# Altium schematic sheet Speed.SchDoc: Speed
size A4; Author: João Guimarães; Organization: Altium Limited; Address1: L3, 12a Rodborough Rd; Address2: Frenchs Forest; Address3: NSW; Address4: Australia 2086; Revision: 2.0
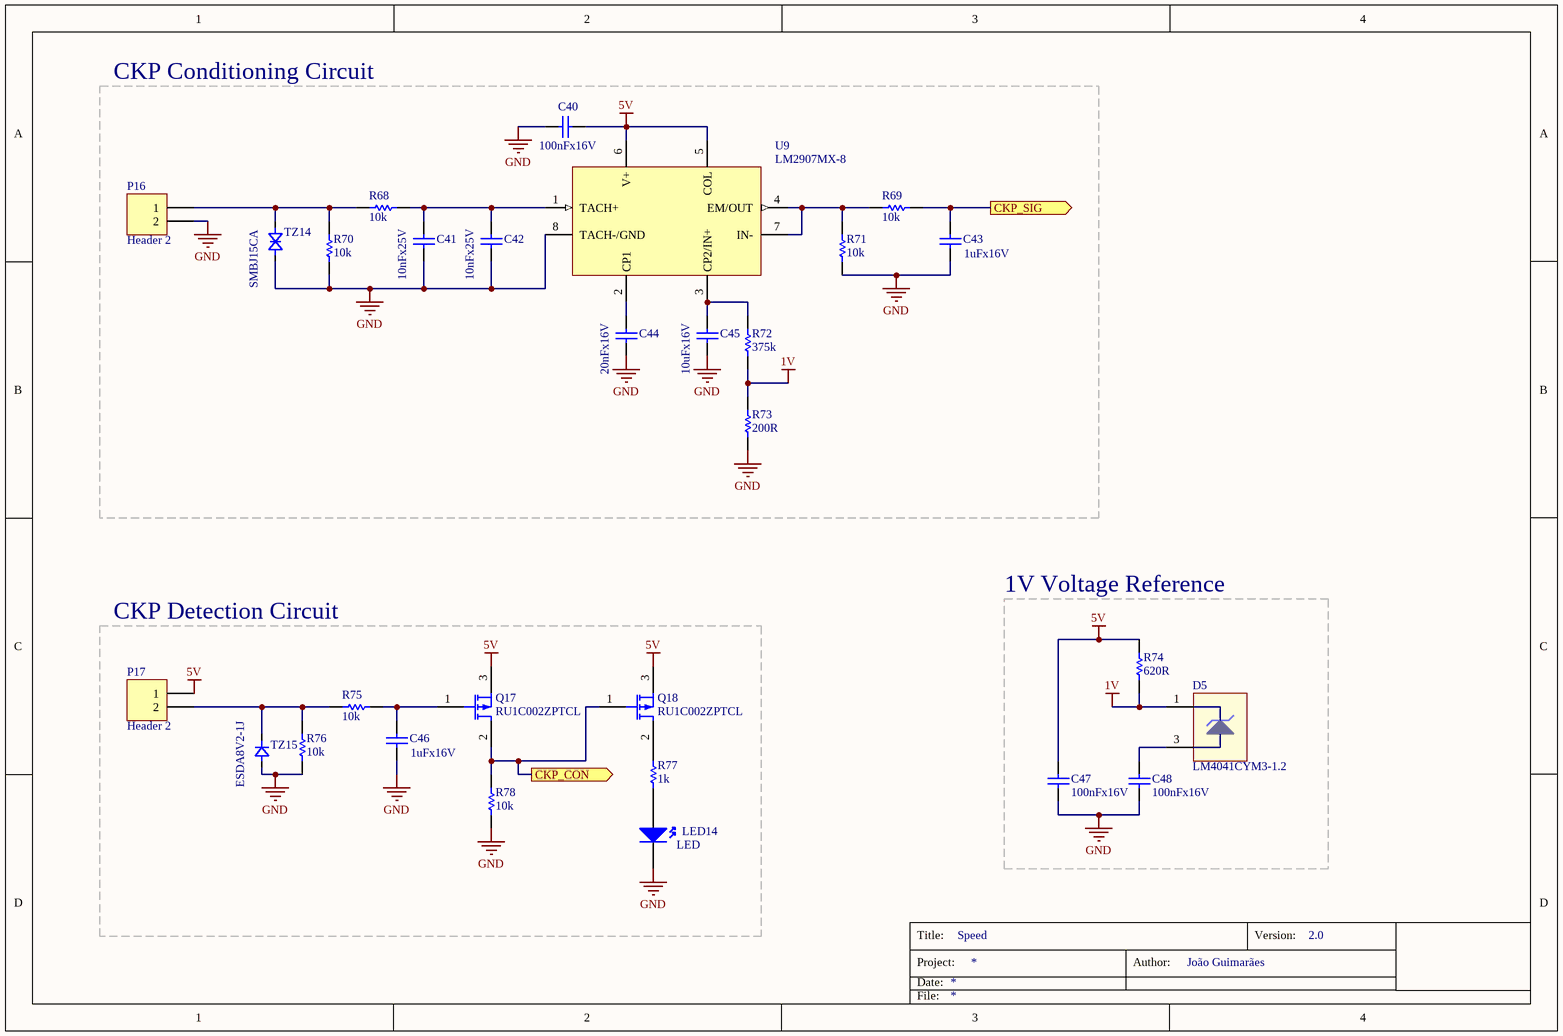
[diagram p0: Speed.SchDoc]

## Parts
C40  100nFx16V  [DISC-0805]
C41  10nFx25V  [DISC-0805]
C42  10nFx25V  [DISC-0805]
C43  1uFx16V  [DISC-0805]
C44  20nFx16V  [DISC-0805]
C45  10uFx16V  [DISC-0805]
C46  1uFx16V  [DISC-0805]
C47  100nFx16V  [DISC-0805]
C48  100nFx16V  [DISC-0805]
D5  LM4041CYM3-1.2  [DISC-SOT-23]
LED14  LED  [DISC-LED-0.1-PTH]
P16  Header 2  [CON-FLEXWIRE-0.5MM2-1X2]
P17  Header 2  [CON-FLEXWIRE-0.5MM2-1X2]
Q17  RU1C002ZPTCL  [DISC-SOT-23]
Q18  RU1C002ZPTCL  [DISC-SOT-23]
R68  10k  [DISC-0805]
R69  10k  [DISC-0805]
R70  10k  [DISC-0805]
R71  10k  [DISC-0805]
R72  375k  [DISC-0805]
R73  200R  [DISC-0805]
R74  620R  [DISC-0805]
R75  10k  [DISC-0805]
R76  10k  [DISC-0805]
R77  1k  [DISC-0805]
R78  10k  [DISC-0805]
TZ14  SMBJ15CA  [DISC-DO214-AA]
TZ15  ESDA8V2-1J  [DISC-SOD-323]
U9  LM2907MX-8  [CI-SOIC-8]

## Blocks framed on the sheet
CKP Conditioning Circuit: C40-C45 P16 R68-R73 TZ14 U9
CKP Detection Circuit: C46 LED14 P17 Q17 Q18 R75-R78 TZ15
1V Voltage Reference: C47 C48 D5 R74

## Ports
CKP_CON (out), CKP_SIG (out)

## Nets
1V: D5.1(A) R72.2 R73.1 R74.2
5V: C40.1 C47.1 P17.1 Q17.3(S) Q18.3(S) R74.1 U9.5(COL) U9.6(V+)
GND: C40.2 C41.1 C42.1 C43.1 C44.1 C45.1 C46.1 C47.2 C48.2 LED14.2(K) P16.2 R70.2 R71.2 R73.2 R76.2 R78.1 TZ14.1(A) TZ15.1(A) U9.8(TACH-/GND)
CKP_CON: Q17.2(D) Q18.1(G) R78.2 ; port CKP_CON
CKP_SIG: C43.2 R69.2 ; port CKP_SIG
NetC41_2: C41.2 C42.2 R68.1 U9.1(TACH+)
NetC44_2: C44.2 U9.2(CP1)
NetC45_2: C45.2 R72.1 U9.3(CP2/IN+)
NetC46_2: C46.2 Q17.1(G) R75.2
NetC48_1: C48.1 D5.3(K)
NetLED14_1: LED14.1(A) R77.1
NetP16_1: P16.1 R68.2 R70.1 TZ14.2(K)
NetP17_2: P17.2 R75.1 R76.1 TZ15.2(C)
NetQ18_2: Q18.2(D) R77.2
NetR69_1: R69.1 R71.1 U9.4(EM/OUT) U9.7(IN-)

Not connected (* = marked no-connect by the designer): D5 2

## Notes on the sheet
- Title:
- Project:
- Date:
- Author:
- Version:
- File:

## Library data of the parts
C40-C48 = Cap: Capacitor
D5 = LM4040: Shunt Voltage References
P16 P17 = Header 2: Header, 2-Pin; LatestRevisionDate: 17-Jul-2002; LatestRevisionNote: Re-released for DXP Platform.; Publisher: Altium Limited
Q17 Q18 = Transistor-PMOS: P-Channel MOSFET
R68-R78 = Res: Resistor
TZ14 = TVZ-Bi-Directional
TZ15 = TVZ-Unidirectional
U9 = LM2907MX-8: Voltage to Frequency & Frequency to Voltage Frequency to Voltage Converter